# Altium project two_ant_fpga_board.PrjPcb
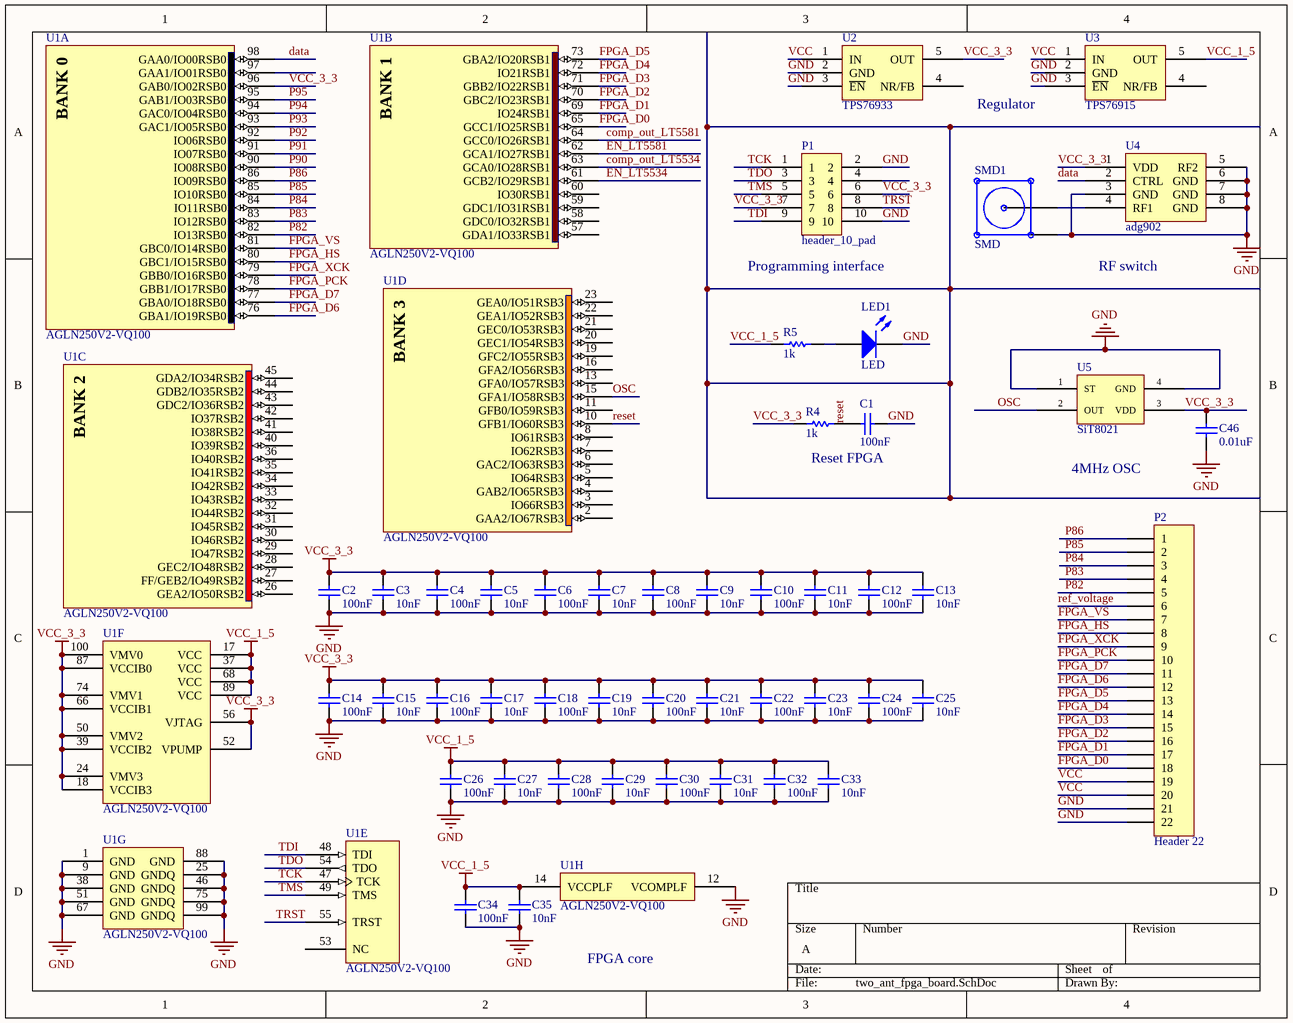
[diagram p0: two_ant_fpga_board.SchDoc]
2 sheets, 63 parts. Net scope: global (net labels, ports and power ports of the same name join across sheets).
Board file: backscatter_tag_pcb.PcbDoc
Sheets:
  two_ant_fpga_board.SchDoc
  envelope_detector.SchDoc

## Sheet two_ant_fpga_board.SchDoc
size A

### Parts
C1  value 100nF  [0603]  (hidden comment: Cap)
C2  value 100nF  [0603]  (hidden comment: Cap)
C3  value 10nF  [0603]  (hidden comment: Cap)
C4  value 100nF  [0603]  (hidden comment: Cap)
C5  value 10nF  [0603]  (hidden comment: Cap)
C6  value 100nF  [0603]  (hidden comment: Cap)
C7  value 10nF  [0603]  (hidden comment: Cap)
C8  value 100nF  [0603]  (hidden comment: Cap)
C9  value 10nF  [0603]  (hidden comment: Cap)
C10  value 100nF  [0603]  (hidden comment: Cap)
C11  value 10nF  [0603]  (hidden comment: Cap)
C12  value 100nF  [0603]  (hidden comment: Cap)
C13  value 10nF  [0603]  (hidden comment: Cap)
C14  value 100nF  [0603]  (hidden comment: Cap)
C15  value 10nF  [0603]  (hidden comment: Cap)
C16  value 100nF  [0603]  (hidden comment: Cap)
C17  value 10nF  [0603]  (hidden comment: Cap)
C18  value 100nF  [0603]  (hidden comment: Cap)
C19  value 10nF  [0603]  (hidden comment: Cap)
C20  value 100nF  [0603]  (hidden comment: Cap)
C21  value 10nF  [0603]  (hidden comment: Cap)
C22  value 100nF  [0603]  (hidden comment: Cap)
C23  value 10nF  [0603]  (hidden comment: Cap)
C24  value 100nF  [0603]  (hidden comment: Cap)
C25  value 10nF  [0603]  (hidden comment: Cap)
C26  value 100nF  [0603]  (hidden comment: Cap)
C27  value 10nF  [0603]  (hidden comment: Cap)
C28  value 100nF  [0603]  (hidden comment: Cap)
C29  value 10nF  [0603]  (hidden comment: Cap)
C30  value 100nF  [0603]  (hidden comment: Cap)
C31  value 10nF  [0603]  (hidden comment: Cap)
C32  value 100nF  [0603]  (hidden comment: Cap)
C33  value 10nF  [0603]  (hidden comment: Cap)
C34  value 100nF  [0603]  (hidden comment: Cap)
C35  value 10nF  [0603]  (hidden comment: Cap)
C46  value 0.01uF  [0603]  (hidden comment: Cap)
LED1  LED  [0603]
P1  header_10_pad  [header_10_pad]
P2  Header 22  [HDR1X22]
R4  value 1k  [0603]  (hidden comment: Res)
R5  value 1k  [0603]  (hidden comment: Res)
SMD1  SMD  [SMD]
U1  AGLN250V2-VQ100  [VQ100_N]  (parts A,B,C,D,E,F,G,H of 8)
U2  TPS76933  [TPS73633]
U3  TPS76915  [TPS73633]
U4  adg902  [ADG902]
U5  SiT8021  [SiT8021]

### Nets
GND: C1.1 C2.1 C3.1 C4.1 C5.1 C6.1 C7.1 C8.1 C9.1 C10.1 C11.1 C12.1 C13.1 C14.1 C15.1 C16.1 C17.1 C18.1 C19.1 C20.1 C21.1 C22.1 C23.1 C24.1 C25.1 C26.1 C27.1 C28.1 C29.1 C30.1 C31.1 C32.1 C33.1 C34.1 C35.1 C46.1 LED1.2(K) P1.2 P1.10 P2.21 P2.22 SMD1.1 U1.1(GND) U1.9(GND) U1.12(VCOMPLF) U1.25(GNDQ) U1.38(GND) U1.46(GNDQ) U1.51(GND) U1.67(GND) U1.75(GNDQ) U1.88(GND) U1.99(GNDQ) U2.2(GND) U2.3(~{EN}) U3.2(GND) U3.3(~{EN}) U4.3(GND) U4.5(RF2) U4.6(GND) U4.7(GND) U4.8(GND) U5.1(ST) U5.4(GND)
VCC_1_5: C26.2 C27.2 C28.2 C29.2 C30.2 C31.2 C32.2 C33.2 C34.2 C35.2 R5.2 U1.14(VCCPLF) U1.17(VCC) U1.37(VCC) U1.68(VCC) U1.89(VCC) U3.5(OUT)
VCC_3_3: C2.2 C3.2 C4.2 C5.2 C6.2 C7.2 C8.2 C9.2 C10.2 C11.2 C12.2 C13.2 C14.2 C15.2 C16.2 C17.2 C18.2 C19.2 C20.2 C21.2 C22.2 C23.2 C24.2 C25.2 C46.2 P1.6 P1.7 R4.2 U1.18(VCCIB3) U1.24(VMV3) U1.39(VCCIB2) U1.50(VMV2) U1.52(VPUMP) U1.56(VJTAG) U1.66(VCCIB1) U1.74(VMV1) U1.87(VCCIB0) U1.96(GAB0/IO02RSB0) U1.100(VMV0) U2.5(OUT) U4.1(VDD) U5.3(VDD)
comp_out_LT5534: U1.63(GCA0/IO28RSB1)
comp_out_LT5581: U1.64(GCC0/IO26RSB1)
data: U1.98(GAA0/IO00RSB0) U4.2(CTRL)
EN_LT5534: U1.61(GCB2/IO29RSB1)
EN_LT5581: U1.62(GCA1/IO27RSB1)
FPGA_D0: P2.18 U1.65(GCC1/IO25RSB1)
FPGA_D1: P2.17 U1.69(IO24RSB1)
FPGA_D2: P2.16 U1.70(GBC2/IO23RSB1)
FPGA_D3: P2.15 U1.71(GBB2/IO22RSB1)
FPGA_D4: P2.14 U1.72(IO21RSB1)
FPGA_D5: P2.13 U1.73(GBA2/IO20RSB1)
FPGA_D6: P2.12 U1.76(GBA1/IO19RSB0)
FPGA_D7: P2.11 U1.77(GBA0/IO18RSB0)
FPGA_HS: P2.8 U1.80(GBC1/IO15RSB0)
FPGA_PCK: P2.10 U1.78(GBB1/IO17RSB0)
FPGA_VS: P2.7 U1.81(GBC0/IO14RSB0)
FPGA_XCK: P2.9 U1.79(GBB0/IO16RSB0)
OSC: U1.15(GFA1/IO58RSB3) U5.2(OUT)
P82: P2.5 U1.82(IO13RSB0)
P83: P2.4 U1.83(IO12RSB0)
P84: P2.3 U1.84(IO11RSB0)
P85: P2.2 U1.85(IO10RSB0)
P86: P2.1 U1.86(IO09RSB0)
P90: U1.90(IO08RSB0)
P91: U1.91(IO07RSB0)
P92: U1.92(IO06RSB0)
P93: U1.93(GAC1/IO05RSB0)
P94: U1.94(GAC0/IO04RSB0)
P95: U1.95(GAB1/IO03RSB0)
ref_voltage: P2.6
reset: C1.2 R4.1 U1.10(GFB1/IO60RSB3)
TCK: P1.1 U1.47(TCK)
TDI: P1.9 U1.48(TDI)
TDO: P1.3 U1.54(TDO)
TMS: P1.5 U1.49(TMS)
TRST: P1.8 U1.55(TRST)
VCC: P2.19 P2.20 U2.1(IN) U3.1(IN)
NetLED1_1: LED1.1(A) R5.1
NetSMD1_2: SMD1.2 U4.4(RF1)

Not connected (* = marked no-connect by the designer): P1 4; U1 2(GAA2/IO67RSB3) 3(IO66RSB3) 4(GAB2/IO65RSB3) 5(IO64RSB3) 6(GAC2/IO63RSB3) 7(IO62RSB3) 8(IO61RSB3) 11(GFB0/IO59RSB3) 13(GFA0/IO57RSB3) 16(GFA2/IO56RSB3) 19(GFC2/IO55RSB3) 20(GEC1/IO54RSB3) 21(GEC0/IO53RSB3) 22(GEA1/IO52RSB3) 23(GEA0/IO51RSB3) 26(GEA2/IO50RSB2) 27(FF/GEB2/IO49RSB2) 28(GEC2/IO48RSB2) 29(IO47RSB2) 30(IO46RSB2) 31(IO45RSB2) 32(IO44RSB2) 33(IO43RSB2) 34(IO42RSB2) 35(IO41RSB2) 36(IO40RSB2) 40(IO39RSB2) 41(IO38RSB2) 42(IO37RSB2) 43(GDC2/IO36RSB2) 44(GDB2/IO35RSB2) 45(GDA2/IO34RSB2) 53(NC) 57(GDA1/IO33RSB1) 58(GDC0/IO32RSB1) 59(GDC1/IO31RSB1) 60(IO30RSB1) 97(GAA1/IO01RSB0); U2 4(NR/FB); U3 4(NR/FB)

### Notes on the sheet
- Regulator
- (near P1) Programming interface
- RF switch
- Reset FPGA
- 4MHz OSC
- FPGA core
- (in symbol AGLN250V2-VQ100, part A) BANK 0
- (in symbol AGLN250V2-VQ100, part B) BANK 1
- (in symbol AGLN250V2-VQ100, part C) BANK 2
- (in symbol AGLN250V2-VQ100, part D) BANK 3

### Library data of the parts
C1-C35 C46 = Cap: Ceramic Capacitor (Surface Mount); Manufacturer: Generic Ceramic Chip Cap (TBD); Digi-Key Part Number: *; Manufacturer Part Number: *; Note: *; Rating: *
P2 = Header 22: Header, 22-Pin; LatestRevisionDate: 17-Jul-2002; LatestRevisionNote: Re-released for DXP Platform.; Publisher: Altium Limited
R4 R5 = Res: Chip Resistor (Surface Mount); Manufacturer: Generic Chip Res (TBD); Manufacturer Part Number: *; Digi-Key Part Number: *; Rating: *
U1 = AGLN250V2-VQ100: IGLOO nano Low-Power Flash 1.2 to 1.5V FPGA with Flash*Freeze, 68 User IOs, 250K System Gates, 1Kbit Flash ROM, 100-Pin TQFP, Commercial Grade; Published: 29-May-2009; LatestRevisionDate: 26-Feb-2010; LatestRevisionNote: Updated to datasheet version 0.8 Jan-2010.; DatasheetVersion: v0.8, Jan-2010; PackageVersion: ver11.2, Nov-2009; PackageReference: VQ100; Publisher: Altium Limited; PackageDescription: 100-Pin Plastic Quad Flat Pack (VQ100); Code_JEDEC: MS-026-AED; ComponentLink1Description: IGLOO nano Datasheet; ComponentLink1URL: http://www.actel.com/documents/IGLOO_nano_DS.pdf; ComponentLink2Description: Package Mechanical Drawings; ComponentLink2URL: http://www.actel.com/documents/PckgMechDrwngs.pdf; ComponentLink3Description: IGLOO nano Documents; ComponentLink3URL: http://www.actel.com/products/igloonano/docs.aspx; ComponentLink4Description: Actel.com Home; ComponentLink4URL: http://www.actel.com/
U2 = TPS76933: TPS73633
U3 = TPS76915: TPS73633

## Sheet envelope_detector.SchDoc
size A
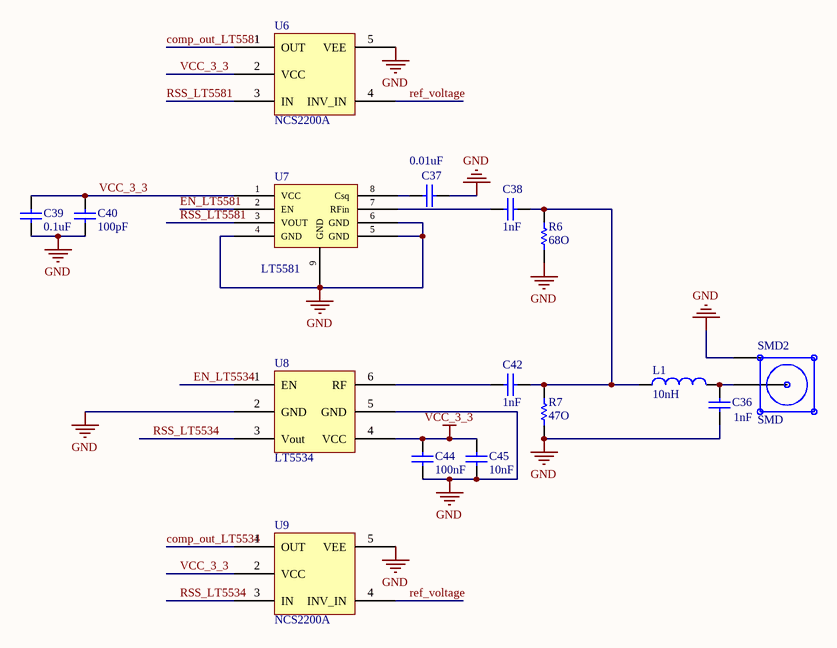
[diagram p1: envelope_detector.SchDoc]

### Parts
C36  value 1nF  [0603]  (hidden comment: Cap)
C37  value 0.01uF  [0603]  (hidden comment: Cap)
C38  value 1nF  [0603]  (hidden comment: Cap)
C39  value 0.1uF  [0603]  (hidden comment: Cap)
C40  value 100pF  [0603]  (hidden comment: Cap)
C42  value 1nF  [0603]  (hidden comment: Cap)
C44  value 100nF  [0603]  (hidden comment: Cap)
C45  value 10nF  [0603]  (hidden comment: Cap)
L1  value 10nH  [0603]  (hidden comment: Ind)
R6  value 68O  [0603]  (hidden comment: Res)
R7  value 47O  [0603]  (hidden comment: Res)
SMD2  SMD  [SMD]
U6  NCS2200A  [NCS2200]
U7  LT5581  [LT5581]
U8  LT5534  [LT5534]
U9  NCS2200A  [NCS2200]

### Nets
GND: C36.1 C37.1 C39.1 C40.1 C44.1 C45.1 R6.1 R7.1 SMD2.1 U6.5(VEE) U7.4(GND) U7.5(GND) U7.6(GND) U7.9(GND) U8.2(GND) U8.5(GND) U9.5(VEE)
VCC_3_3: C39.2 C40.2 C44.2 C45.2 U6.2(VCC) U7.1(VCC) U8.4(VCC) U9.2(VCC)
comp_out_LT5534: U9.1(OUT)
comp_out_LT5581: U6.1(OUT)
EN_LT5534: U8.1(EN)
EN_LT5581: U7.2(EN)
ref_voltage: U6.4(INV_IN) U9.4(INV_IN)
RSS_LT5534: U8.3(Vout) U9.3(IN)
RSS_LT5581: U6.3(IN) U7.3(VOUT)
NetC36_2: C36.2 L1.2 SMD2.2
NetC37_2: C37.2 U7.8(Csq)
NetC38_1: C38.1 U7.7(RFin)
NetC38_2: C38.2 C42.2 L1.1 R6.2 R7.2
NetC42_1: C42.1 U8.6(RF)

### Library data of the parts
C36-C40 C42 C44 C45 = Cap: as C1 on sheet two_ant_fpga_board; Digi-Key Part Number: *; Manufacturer Part Number: *; Note: *; Rating: *
L1 = Ind: Inductor (Surface Mount); Digi-Key Part Number: *; Manufacturer: *; Manufacturer Part Number: *; Rating: *; Note: *
R6 R7 = Res: as R4 on sheet two_ant_fpga_board; Manufacturer Part Number: *; Digi-Key Part Number: *; Rating: *

## Nets that join several sheets
GND: two_ant_fpga_board (64 pins), envelope_detector (17 pins)
VCC_3_3: two_ant_fpga_board (42 pins), envelope_detector (8 pins)
comp_out_LT5534: two_ant_fpga_board (U1.63), envelope_detector (U9.1)
comp_out_LT5581: two_ant_fpga_board (U1.64), envelope_detector (U6.1)
EN_LT5534: two_ant_fpga_board (U1.61), envelope_detector (U8.1)
EN_LT5581: two_ant_fpga_board (U1.62), envelope_detector (U7.2)
ref_voltage: two_ant_fpga_board (P2.6), envelope_detector (U6.4 U9.4)